# EAGLE design ItchStimulator (EAGLE 7.7.0)
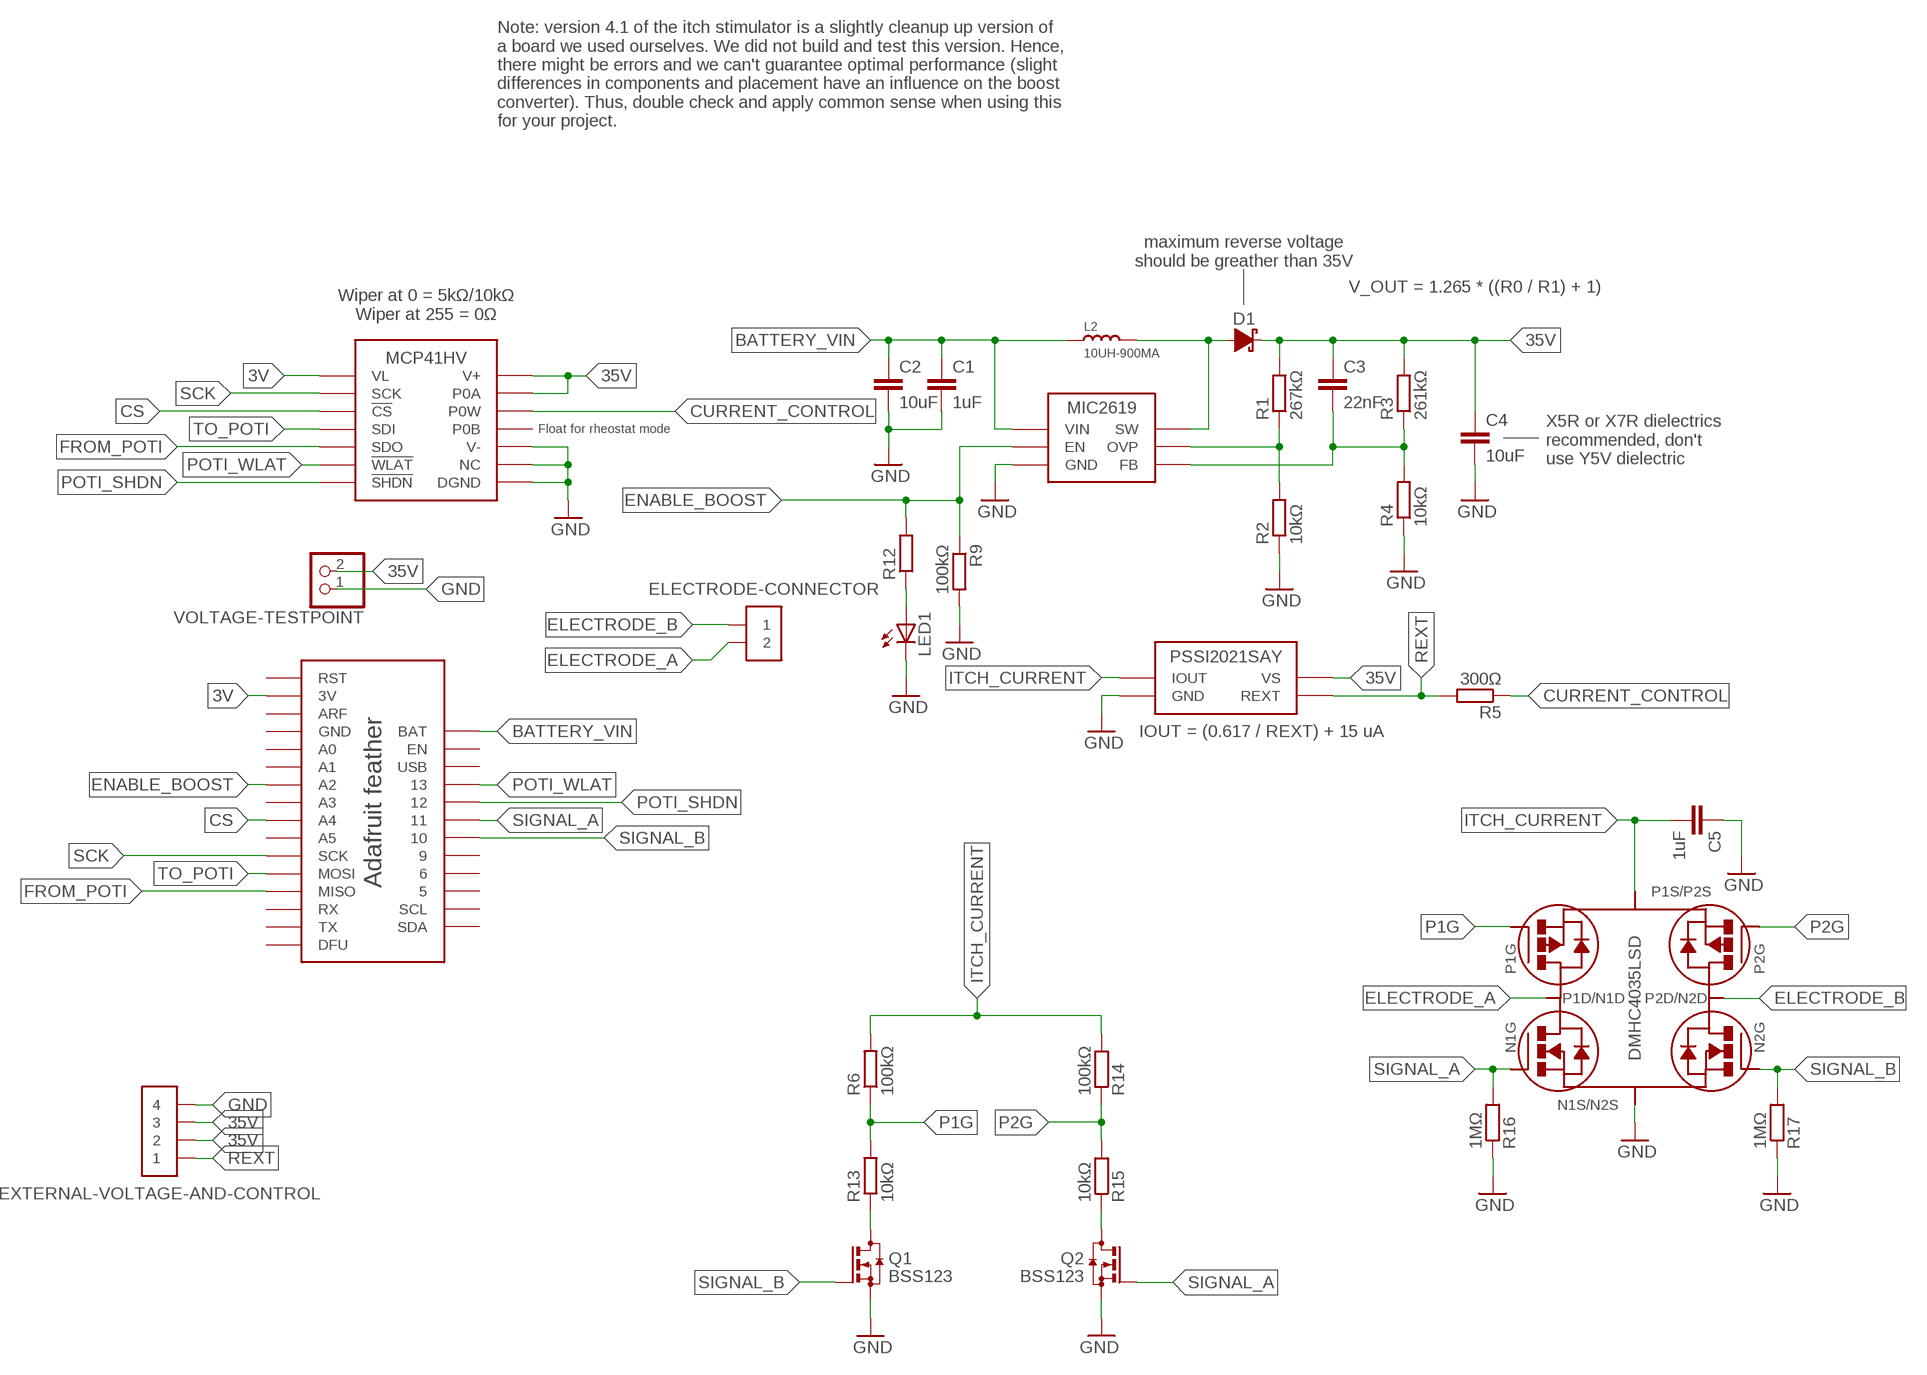
[diagram p0: schematic, sheet 1]

## Parts
C1  1uF  C-EUC0805K  [C0805K]
C2  10uF  C-EUC0805K  [C0805K]
C3  22nF  C-EUC0805K  [C0805K]
C4  10uF  C-EUC0805K  [C0805K]
C5  1uF  C-EUC0805K  [C0805K]
D1  DIODE-SCHOTTKY  [DO-214AA]
ELECTRODE-CONNECTOR  2-PIN_HEADER  [SAMTEC-TSM-102-01-X-SH]
EXTERNAL-VOLTAGE-AND-CONTROL  4-PIN_HEADER  [SAMTEC-TSM-104-01-X-SH]
L2  10UH-900MA  SMD-INDUCTOR-10UH-20%-900MA(L1210)  [L1210]
LED1  LEDSML0805  [SML0805]
MCP41HV  MCP41HV  [TSSOP-14]
MIC2619  MIC2619  [TSOT-23-6]
PSSI2021SAY  PSSI2021SAY  [SOT-353]
Q1  BSS123  [SOT23]
Q2  BSS123  [SOT23]
R1  267kΩ  R-EU_R0805  [R0805]
R2  10kΩ  R-EU_R0805  [R0805]
R3  261kΩ  R-EU_R0805  [R0805]
R4  10kΩ  R-EU_R0805  [R0805]
R5  300Ω  R-EU_R0805  [R0805]
R6  100kΩ  R-EU_R0805  [R0805]
R9  100kΩ  R-EU_R0805  [R0805]
R12  R-EU_R0805  [R0805]
R13  10kΩ  R-EU_R0805  [R0805]
R14  100kΩ  R-EU_R0805  [R0805]
R15  10kΩ  R-EU_R0805  [R0805]
R16  1MΩ  R-EU_R0805  [R0805]
R17  1MΩ  R-EU_R0805  [R0805]
U$1  ADAFRUIT_FEATHER_M0_BLUETOOTH  [ADAFRUIT_FEATHER_M0_BLUETOOTH]
U$2  DMHC4035LSD  [SOIC-8]
VOLTAGE-TESTPOINT  PINHD-1X2  [1X02]

## Nets
3V: MCP41HV.P$1(VL) U$1.P$15(3V)
35V: C3.1 C4.1 D1.CATHODE EXTERNAL-VOLTAGE-AND-CONTROL.P$2 EXTERNAL-VOLTAGE-AND-CONTROL.P$3 MCP41HV.P$13(P0A) MCP41HV.P$14(V+) PSSI2021SAY.P$5(VS) R1.2 R3.2 VOLTAGE-TESTPOINT.2
BATTERY_VIN: C1.1 C2.1 L2.1 MIC2619.P$6(VIN) U$1.P$17(BAT)
CS: MCP41HV.P$3(!CS) U$1.P$8(A4)
CURRENT_CONTROL: MCP41HV.P$12(P0W) R5.1
ELECTRODE_A: ELECTRODE-CONNECTOR.P$2 U$2.P$2(P1D/N1D)
ELECTRODE_B: ELECTRODE-CONNECTOR.P$1 U$2.P$6(P2D/N2D)
ENABLE_BOOST: MIC2619.P$4(EN) R9.1 R12.2 U$1.P$10(A2)
FROM_POTI: MCP41HV.P$5(SDO) U$1.P$4(MISO)
GND: C1.2 C2.2 C4.2 C5.1 EXTERNAL-VOLTAGE-AND-CONTROL.P$4 LED1.C MCP41HV.P$8(DGND) MCP41HV.P$9(NC) MCP41HV.P$10(V-) MIC2619.P$2(GND) PSSI2021SAY.P$3(GND) Q1.2(S) Q2.2(S) R2.1 R4.1 R9.2 R16.1 R17.1 U$2.P$3(N1S/N2S) VOLTAGE-TESTPOINT.1
ITCH_CURRENT: C5.2 PSSI2021SAY.P$2(IOUT) R6.2 R14.2 U$2.P$7(P1S/P2S)
N$1: D1.ANODE L2.2 MIC2619.P$1(SW)
N$2: C3.2 MIC2619.P$3(FB) R3.1 R4.2
N$3: LED1.A R12.1
N$4: MIC2619.P$5(OVP) R1.1 R2.2
N$5: Q1.3(D) R13.1
N$10: Q2.3(D) R15.1
P1G: R6.1 R13.2 U$2.P$8(P1G)
P2G: R14.1 R15.2 U$2.P$5(P2G)
POTI_SHDN: MCP41HV.P$7(!SHDN) U$1.P$21
POTI_WLAT: MCP41HV.P$6(!WLAT) U$1.P$20
REXT: EXTERNAL-VOLTAGE-AND-CONTROL.P$1 PSSI2021SAY.P$4(REXT) R5.2
SCK: MCP41HV.P$2(SCK) U$1.P$6(SCK)
SIGNAL_A: Q2.1(G) R16.2 U$1.P$22 U$2.P$1(N1G)
SIGNAL_B: Q1.1(G) R17.2 U$1.P$23 U$2.P$4(N2G)
TO_POTI: MCP41HV.P$4(SDI) U$1.P$5(MOSI)
Unconnected: MCP41HV.P$11(P0B) U$1.P$1(DFU) U$1.P$2(TX) U$1.P$3(RX) U$1.P$7(A5) U$1.P$9(A3) U$1.P$11(A1) U$1.P$12(A0) U$1.P$14(ARF) U$1.P$16(RST) U$1.P$18(EN) U$1.P$24 U$1.P$25 U$1.P$26 U$1.P$27(SCL) U$1.P$28(SDA)

## Notes on the sheet
- Note: version 4.1 of the itch stimulator is a slightly cleanup up version of 
  a board we used ourselves. We did not build and test this version. Hence, 
  there might be errors and we can't guarantee optimal performance (slight 
  differences in components and placement have an influence on the boost 
  converter). Thus, double check and apply common sense when using this 
  for your project.
- maximum reverse voltage
  should be greather than 35V
- V_OUT = 1.265 * ((R0 / R1) + 1)
- Wiper at 0 = 5kΩ/10kΩ
  Wiper at 255 = 0Ω
- Float for rheostat mode
- X5R or X7R dielectrics
  recommended, don't 
  use Y5V dielectric
- IOUT = (0.617 / REXT) + 15 uA

## Power pins joined to a net without a drawn wire
GND: U$1.P$13(GND)
USB: U$1.P$19(USB)

## Library data of the parts
C1-C5 = resistor:C-EU: CAPACITOR, European symbol
D1 = talons-basics:DIODE-SCHOTTKY
ELECTRODE-CONNECTOR = talons-connectors:2-PIN_HEADER
EXTERNAL-VOLTAGE-AND-CONTROL = talons-connectors:4-PIN_HEADER
L2 = Seeed-OPL-Inductor:SMD-INDUCTOR-10UH-20%-900MA(L1210): 303010108; MPN: CBC3225T100MR
LED1 = led:LED: LED OSRAM: - CHIPLED LG R971, LG N971, LY N971, LG Q971, LY Q971, LO R971, LY R971 LH N974, LH R974 LS Q976, LO Q976, LY Q976 LO Q996 - Hyper CHIPLED LW Q18S LB Q993, LB Q99A, LB R99A - SideLED LS A670, LO A670, LY A670, LG A670, LP A670 LB A673, LV A673, LT A673, LW A673 LH A674 LY A675 LS A676, LA A676, LO A676, LY A676, LW A676 LS A679, LY A679, LG A679 - Hyper Micro SIDELED® LS Y876, LA Y876, LO Y876, LY Y876 LT Y87S - SmartLED LW L88C, LW L88S LB L89C, LB L89S, LG L890 LS L89K, LO L89K, LY L89K LS L896, LA L896, LO L896, LY L896 - TOPLED LS T670, LO T670, LY T670, LG T670, LP T670 LSG T670, LSP T670, LSY T670, LOP T670, LYG T670 LG T671, LOG T671, LSG T671 LB T673, LV T673, LT T673, LW T673 LH T674 LS T676, LA T676, LO T676, LY T676, LB T676, LH T676, LSB T676, LW T676 LB T67C, LV T67C, LT T67C, LS T67K, LO T67K, LY T67K, LW E67C LS E67B, LA E67B, LO E67B, LY E67B, LB E67C, LV E67C, LT E67C LW T67C LS T679, LY T679, LG T679 LS T770, LO T770, LY T770, LG T770, LP T770 LB T773, LV T773, LT T773, LW T773 LH T774 LS E675, LA E675, LY E675, LS T675 LS T776, LA T776, LO T776, LY T776, LB T776 LHGB T686 LT T68C, LB T68C - Hyper Mini TOPLED® LB M676 - Mini TOPLED Santana® LG M470 LS M47K, LO M47K, LY M47K Source: http://www.osram.convergy.de LUXEON: - LUMILED® LXK2-PW12-R00, LXK2-PW12-S00, LXK2-PW14-U00, LXK2-PW14-V00 LXK2-PM12-R00, LXK2-PM12-S00, LXK2-PM14-U00 LXK2-PE12-Q00, LXK2-PE12-R00, LXK2-PE12-S00, LXK2-PE14-T00, LXK2-PE14-U00 LXK2-PB12-K00, LXK2-PB12-L00, LXK2-PB12-M00, LXK2-PB14-N00, LXK2-PB14-P00, LXK2-PB14-Q00 LXK2-PR12-L00, LXK2-PR12-M00, LXK2-PR14-Q00, LXK2-PR14-R00 LXK2-PD12-Q00, LXK2-PD12-R00, LXK2-PD12-S00 LXK2-PH12-R00, LXK2-PH12-S00 LXK2-PL12-P00, LXK2-PL12-Q00, LXK2-PL12-R00 Source: www.luxeon.com KINGBRIGHT: KA-3528ASYC Source: www.kingbright.com
MCP41HV = talons-basics:MCP41HV: 7/8-Bit Single, +36V (±18V) Digital POT with SPI Serial Interface and Volatile Memory Manufacturer <http://www.microchip.com/wwwproducts/en/en561198> Octopart <https://octopart.com/search?q=MCP41HV>
MIC2619 = talons-power:MIC2619: MIC2619 1.2MHz PWM Boost Converter with OVP Manufacturer <http://www.microchip.com/wwwproducts/en/MIC2619> Octopart <https://octopart.com/mic2619yd6-tr-microchip-66801025>
PSSI2021SAY = talons-power:PSSI2021SAY: NXP PSSI2021SAY: Constant current source in SOT353 package Manufacturer <http://www.nxp.com/products/discretes-and-logic/bipolar-transistors/general-purpose-bipolar-transistors/constant-current-source/constant-current-source-in-sot353-package:PSSI2021SAY> Octopart <https://octopart.com/search?q=pssi2021say> Farnell.de <http://de.farnell.com/nxp/pssi2021say-115/ic-current-source-50ma-75v-sot353/dp/1758034?ost=1758034&categoryId=700000004321&searchView=table&iscrfnonsku=false>
Q1 Q2 = transistor-small-signal:BSS123: N-CHANNEL MOS FET
R1-R6 R9 R12-R17 = resistor:R-EU_: RESISTOR, European symbol
U$1 = talons-microcontrollers:ADAFRUIT_FEATHER_M0_BLUETOOTH: Adafruit Feather https://www.adafruit.com/feather https://learn.adafruit.com/adafruit-feather-m0-bluefruit-le
U$2 = talons-actuation:DMHC4035LSD: DMHC4035LSD: 40V Complementary Enhancement Mode MOSFET H-Bridge Manufacturer <http://www.diodes.com/catalog/H-Bridge_MOSFETs_32/DMHC4035LSD_10422> Octopart <https://octopart.com/dmhc4035lsd-13-diodes+inc.-30589190>
VOLTAGE-TESTPOINT = pinhead:PINHD-1X2: PIN HEADER

## Board
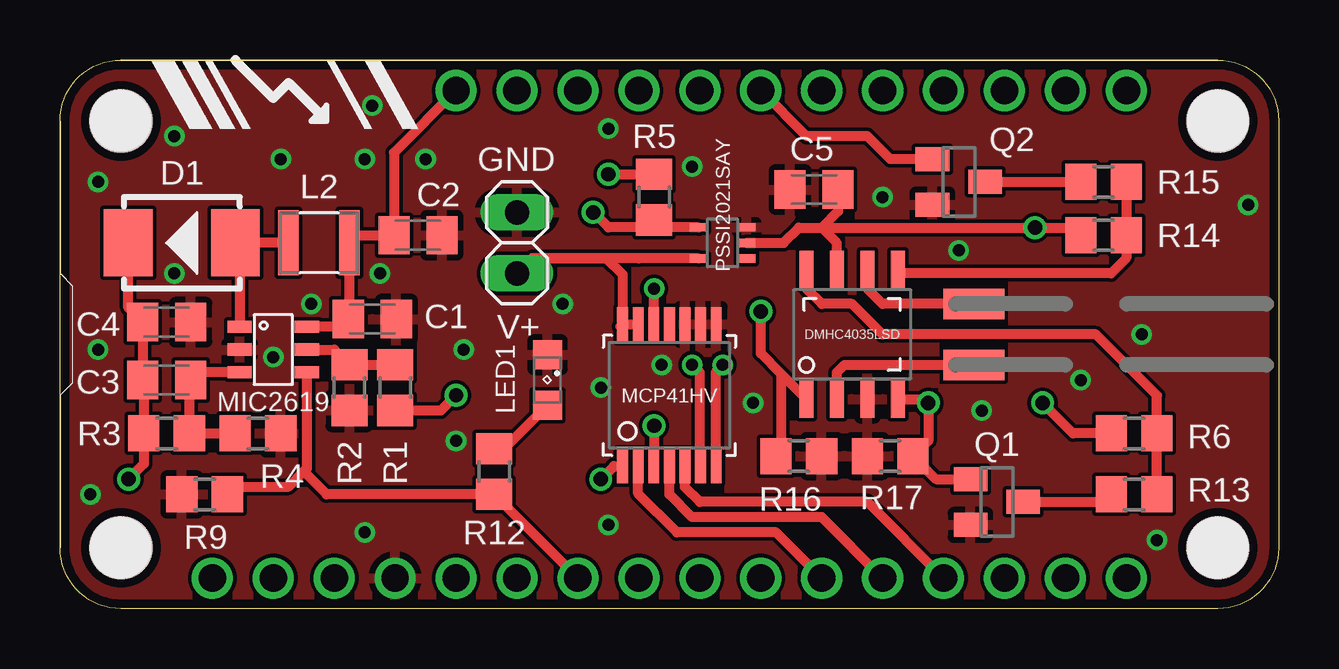
[diagram p1: board, top side]
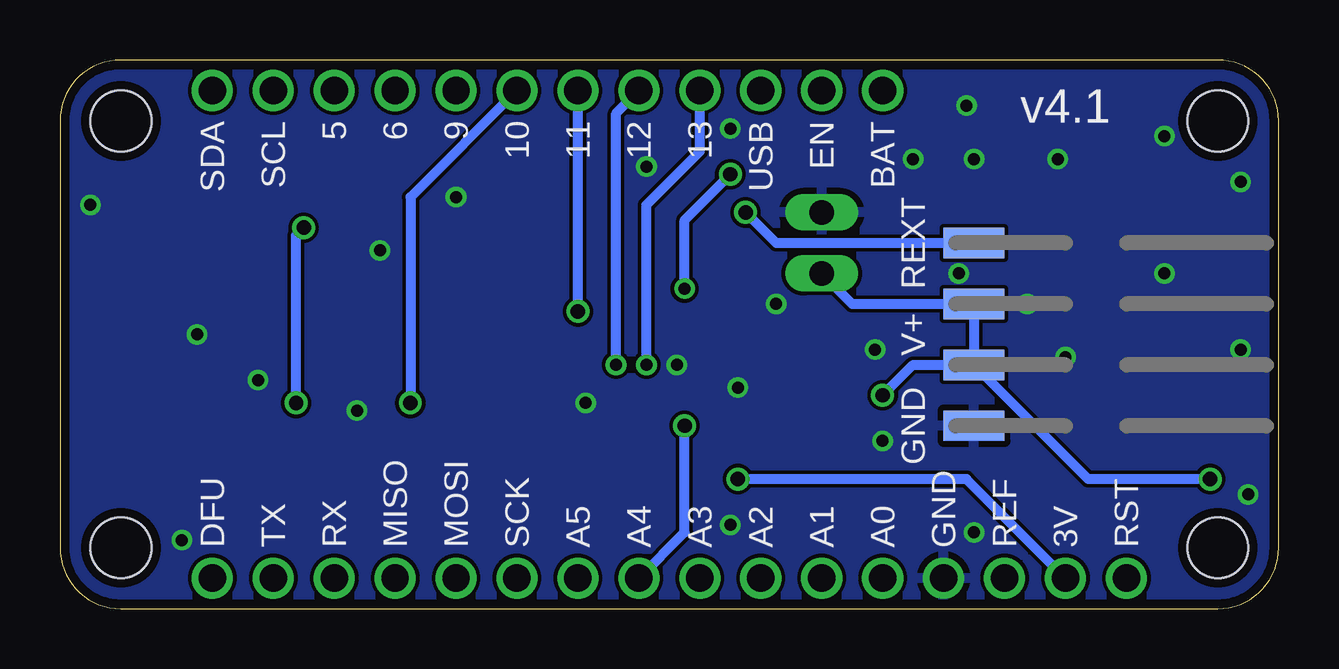
[diagram p2: board, bottom side, seen from below]

Size 50.8 x 22.86 mm. Coordinates in mm from the lower left corner, seen from the top.
Outline: 0,2.54 0,20.32 arc-90 2.54,22.86 48.26,22.86 arc-90 50.8,20.32 50.8,2.54 arc-90 48.26,0 2.54,0 arc-90 0,2.54
Copper layers (1*16): Top 0.0356mm / dielectric 1.5011mm / Bottom 0.0356mm
Design rules "oshpark-2layer *": minimum track width 6mil, minimum drill 13mil, track to track 6mil, track to pad 6mil, pad to pad 6mil, via to via 6mil, smd to smd 6mil, copper to edge 15mil, drill to drill 6mil, minimum pad ring 7mil, minimum via ring 7mil, stop-mask expansion 2.5mil, vias tented up to drill 30mil, thermal gap 10mil
Holes 2.54 mm at 48.26,20.32 48.26,2.54 2.54,2.54 2.54,20.32

### Footprints (pad centres in the part's own frame; a part is rotated, then mirrored left to right if it is on the bottom)
C0805K = smd 1.3 x 1.6: 1 -1,0; 2 1,0
DO-214AA = smd 2.032 x 2.794: ANODE -2.235,0; CATHODE 2.235,0
SAMTEC-TSM-102-01-X-SH = smd 1.27 x 2.54: P$1 -1.27,0; P$2 1.27,0
SAMTEC-TSM-104-01-X-SH = smd 1.27 x 2.54: P$1 -2.54,-1.27; P$2 0,-1.27; P$3 2.54,-1.27; P$4 5.08,-1.27
L1210 = smd 0.85 x 2.7: 1 -1.275,0; 2 1.275,0
SML0805 = smd 1.2 x 1.2: A 1.05,0; C -1.05,0
TSSOP-14 = smd 0.45 x 1.45: P$1 -1.95,-2.95; P$2 -1.3,-2.95; P$3 -0.65,-2.95; P$4 0,-2.95; P$5 0.65,-2.95; P$6 1.3,-2.95; P$7 1.95,-2.95; P$8 1.95,2.95; P$9 1.3,2.95; P$10 0.65,2.95; P$11 0,2.95; P$12 -0.65,2.95; P$13 -1.3,2.95; P$14 -1.95,2.95
TSOT-23-6 = smd 0.508 x 1.016: P$1 -0.95,-1.4; P$2 0,-1.4; P$3 0.95,-1.4; P$4 0.95,1.4; P$5 0,1.4; P$6 -0.95,1.4
SOT-353 = smd 0.35 x 0.75: P$1 -0.65,-1; P$2 0,-1; P$3 0.65,-1; P$4 0.65,1; P$5 -0.65,1
SOT23 = smd 1 x 1.4: 1 -0.95,-1.1; 2 0.95,-1.1; 3 0,1.1
R0805 = smd 1.3 x 1.5: 1 -0.95,0; 2 0.95,0
ADAFRUIT_FEATHER_M0_BLUETOOTH = drill 1.143: P$1 44.45,1.27; P$2 41.91,1.27; P$3 39.37,1.27; P$4 36.83,1.27; P$5 34.29,1.27; P$6 31.75,1.27; P$7 29.21,1.27; P$8 26.67,1.27; P$9 24.13,1.27; P$10 21.59,1.27; P$11 19.05,1.27; P$12 16.51,1.27; P$13 13.97,1.27; P$14 11.43,1.27; P$15 8.89,1.27; P$16 6.35,1.27; P$17 16.51,21.59; P$18 19.05,21.59; P$19 21.59,21.59; P$20 24.13,21.59; P$21 26.67,21.59; P$22 29.21,21.59; P$23 31.75,21.59; P$24 34.29,21.59; P$25 36.83,21.59; P$26 39.37,21.59; P$27 41.91,21.59; P$28 44.45,21.59
SOIC-8 = smd 0.6 x 1.55: P$1 -1.905,-2.7; P$2 -0.635,-2.7; P$3 0.635,-2.7; P$4 1.905,-2.7; P$5 1.905,2.7; P$6 0.635,2.7; P$7 -0.635,2.7; P$8 -1.905,2.7
1X02 = drill 1.016 long: 1 -1.27,0; 2 1.27,0

### Placement (x,y rotation side)
C1  13.02,12.06 0 top
C2  14.92,15.56 0 top
C3  4.45,9.52 0 top
C4  4.45,11.94 0 top
C5  31.43,17.46 0 top
D1  5.08,15.24 180 top
ELECTRODE-CONNECTOR  38.1,11.43 270 top
EXTERNAL-VOLTAGE-AND-CONTROL  11.43,12.7 270 bottom
L2  10.79,15.24 180 top
LED1  20.32,9.52 270 top
MCP41HV  25.4,8.89 0 top
MIC2619  8.89,10.79 270 top
PSSI2021SAY  27.62,15.24 90 top
Q1  39.05,4.44 270 top
Q2  37.46,17.78 270 top
R1  13.97,9.21 270 top
R2  12.06,9.21 90 top
R3  4.45,7.3 180 top
R4  8.25,7.3 180 top
R5  24.77,17.14 270 top
R6  44.77,7.3 180 top
R9  6.03,4.76 180 top
R12  18.1,5.71 270 top
R13  44.77,4.76 0 top
R14  43.5,15.56 180 top
R15  43.5,17.78 0 top
R16  30.8,6.35 180 top
R17  34.61,6.35 0 top
U$1  0,0 0 top
U$2  33.02,11.43 0 top
VOLTAGE-TESTPOINT  19.05,15.24 270 top

### Tracks (layer width: path | path; a pad name or v marks a point on that pad's centre or on a via)
3V  (via drill 0.6)
  Top 0.406: v22.54,5.4 23.09,5.94 MCP41HV.P$1
  Bottom 0.406: U$1.P$15 13.02,5.4 v22.54,5.4
35V  (via drill 0.6)
  Top 0.406: MCP41HV.P$14 MCP41HV.P$13 | 2.21,14.6 D1.CATHODE 2.84,12.54 C4.1 C3.1 3.49,9.48 R3.2 | 26.29,14.6 PSSI2021SAY.P$5 24.12,14.59 19.69,14.6 | MCP41HV.P$14 23.45,13.92 22.77,14.6 19.69,14.6 | 23.36,11.75 MCP41HV.P$14 | VOLTAGE-TESTPOINT.2 19.69,14.6 | R3.2 | R3.2 3.49,6.03 v2.86,5.4 | R1.2 15.88,8.26 v16.51,8.89
  Bottom 0.406: VOLTAGE-TESTPOINT.2 17.78,12.7 EXTERNAL-VOLTAGE-AND-CONTROL.P$2 EXTERNAL-VOLTAGE-AND-CONTROL.P$3 | v2.86,5.4 7.94,5.4 EXTERNAL-VOLTAGE-AND-CONTROL.P$3 | v16.51,8.89 15.24,10.16 EXTERNAL-VOLTAGE-AND-CONTROL.P$3
BATTERY_VIN
  Top 0.406: MIC2619.P$6 12.02,11.74 C1.1 12.07,12.12 L2.1 12.39,15.56 C2.1 13.92,19 U$1.P$17
CS  (via drill 0.6)
  Top 0.406: v24.77,7.62 24.75,7.6 MCP41HV.P$3
  Bottom 0.406: U$1.P$8 24.77,3.17 v24.77,7.62
CURRENT_CONTROL  (via drill 0.5, 0.6)
  Top 0.406: MCP41HV.P$12 24.77,11.85 v24.77,13.33 | v22.86,18.1 v22.86,18.09 R5.1
  Bottom 0.406: v24.77,13.33 24.77,16.19 v22.86,18.1
ELECTRODE_A
  Top 0.406: U$2.P$2 32.38,9.84 32.7,10.16 ELECTRODE-CONNECTOR.P$2
ELECTRODE_B
  Top 0.406: ELECTRODE-CONNECTOR.P$1 34.29,12.7 33.66,13.33 U$2.P$6
ENABLE_BOOST
  Top 0.406: MIC2619.P$4 10.29,5.84 10.16,5.71 | R9.1 6.66,5.08 9.52,5.08 10.16,5.71 | U$1.P$10 R12.2 11.11,4.76 10.16,5.71
FROM_POTI
  Top 0.406: U$1.P$4 33.66,4.44 26.67,4.44 26.05,5.06 MCP41HV.P$5
GND  (via drill 0.5)
  other vias: 45.72,2.86 1.59,17.78 13.02,20.96 10.48,12.7 4.76,19.68 4.76,13.97 22.86,20 26.35,18.41 45.09,11.43 49.53,16.83 8.89,10.48 38.42,8.25 28.89,8.57 42.55,9.52 1.27,4.76 12.7,3.17 22.86,3.49 25.08,10.16 37.46,14.92 34.29,17.14 12.7,18.73 9.21,18.73 20.95,12.7 22.54,9.21 16.83,10.79 15.24,18.73 13.34,13.97 16.51,6.98 1.59,10.79
  pour Bottom: -1.27,24.13 52.07,24.13 52.07,-1.27 -1.27,-1.27
  pour Top: -1.27,24.13 52.07,24.13 52.07,-1.27 -1.27,-1.27
ITCH_CURRENT  (via drill 0.6)
  Top 0.406: PSSI2021SAY.P$2 30.16,15.24 30.8,15.87 31.75,15.87 | 31.75,15.87 v40.64,15.87 42.23,15.87 R14.2 | C5.2 32.43,16.56 31.75,15.87 | U$2.P$7 32.38,15.24 31.75,15.87 | R6.2 42.23,7.3 v40.96,8.57
  Bottom 0.406: v40.96,8.57 40.96,15.56 v40.64,15.87
N$1
  Top 0.406: MIC2619.P$1 7.49,14.14 7.63,14.29 D1.ANODE L2.2
N$2
  Top 0.406: MIC2619.P$3 5.77,9.84 C3.2 5.39,9.47 R3.1 R4.2
N$3
  Top 0.406: R12.1 18.51,6.66 LED1.A
N$4
  Top 0.406: R1.1 R2.2 11.43,10.79 MIC2619.P$5
N$5
  Top 0.406: Q1.3 43.5,4.44 R13.1
N$10
  Top 0.406: Q2.3 R15.1
P1G
  Top 0.406: R13.2 R6.1 45.72,8.89 43.18,11.43 34.29,11.43 33.02,12.7 31.75,12.7 31.12,13.33 U$2.P$8
P2G
  Top 0.406: R15.2 R14.1 44.45,14.6 43.82,13.97 35.09,13.97 U$2.P$5
POTI_SHDN  (via drill 0.5)
  Top 0.406: MCP41HV.P$7 27.35,9.89 v27.62,10.16
  Bottom 0.406: v27.62,10.16 27.62,20.64 U$1.P$21
POTI_WLAT  (via drill 0.5)
  Top 0.406: MCP41HV.P$6 26.67,5.97 26.67,9.84 v26.35,10.16
  Bottom 0.406: v26.35,10.16 26.35,16.83 24.13,19.05 U$1.P$20
REXT  (via drill 0.6)
  Top 0.406: PSSI2021SAY.P$4 24.77,15.89 | 24.77,15.89 R5.2 | 24.77,15.89 22.86,15.89 v22.23,16.51
  Bottom 0.406: v22.23,16.51 20.95,15.24 EXTERNAL-VOLTAGE-AND-CONTROL.P$1
SCK
  Top 0.406: U$1.P$6 29.84,3.17 25.72,3.17 24.1,4.79 MCP41HV.P$2
SIGNAL_A  (via drill 0.6)
  Top 0.406: Q2.1 34.61,18.73 33.66,19.68 31.12,19.68 U$1.P$22 | U$2.P$1 30.08,9.76 | 30.08,9.76 29.21,10.63 v29.21,12.38 | R16.2 30.08,6.58 30.08,9.76
  Bottom 0.406: v29.21,12.38 U$1.P$22
SIGNAL_B  (via drill 0.6)
  Top 0.406: R17.2 36.51,5.39 Q1.1 | R17.2 35.88,6.67 | R17.2 36.2,6.99 v36.2,8.57 36.04,8.73 U$2.P$4
  Bottom 0.406: U$1.P$23 36.2,17.14 v36.2,8.57
TO_POTI
  Top 0.406: U$1.P$5 31.75,3.81 26.35,3.81 25.4,4.76 MCP41HV.P$4

### Text on the board
tPlace: GND | V+
bPlace: v4.1 | BAT | EN | USB | 13 | 12 | 11 | 10 | 9 | 6 | 5 | SCL | SDA | RST | 3V | REF | GND | A0 | A1 | A2 | A3 | A4 | A5 | SCK | MOSI | MISO | RX | TX | DFU
bNames: REXT | V+ | GND